# EasyEDA Pro project ProPrj_PCB_Design_2025-03-01.epro

# Schematic Aux Board
Board Name: Aux Board; Create Date: 2025-02-28; Page Name: P1; Project Name: PCB_Design; Schematic Name: Aux Board; Update Date: 2025-02-28; Company: EasyEDA.com; Page Size: A4; Version: V1.0
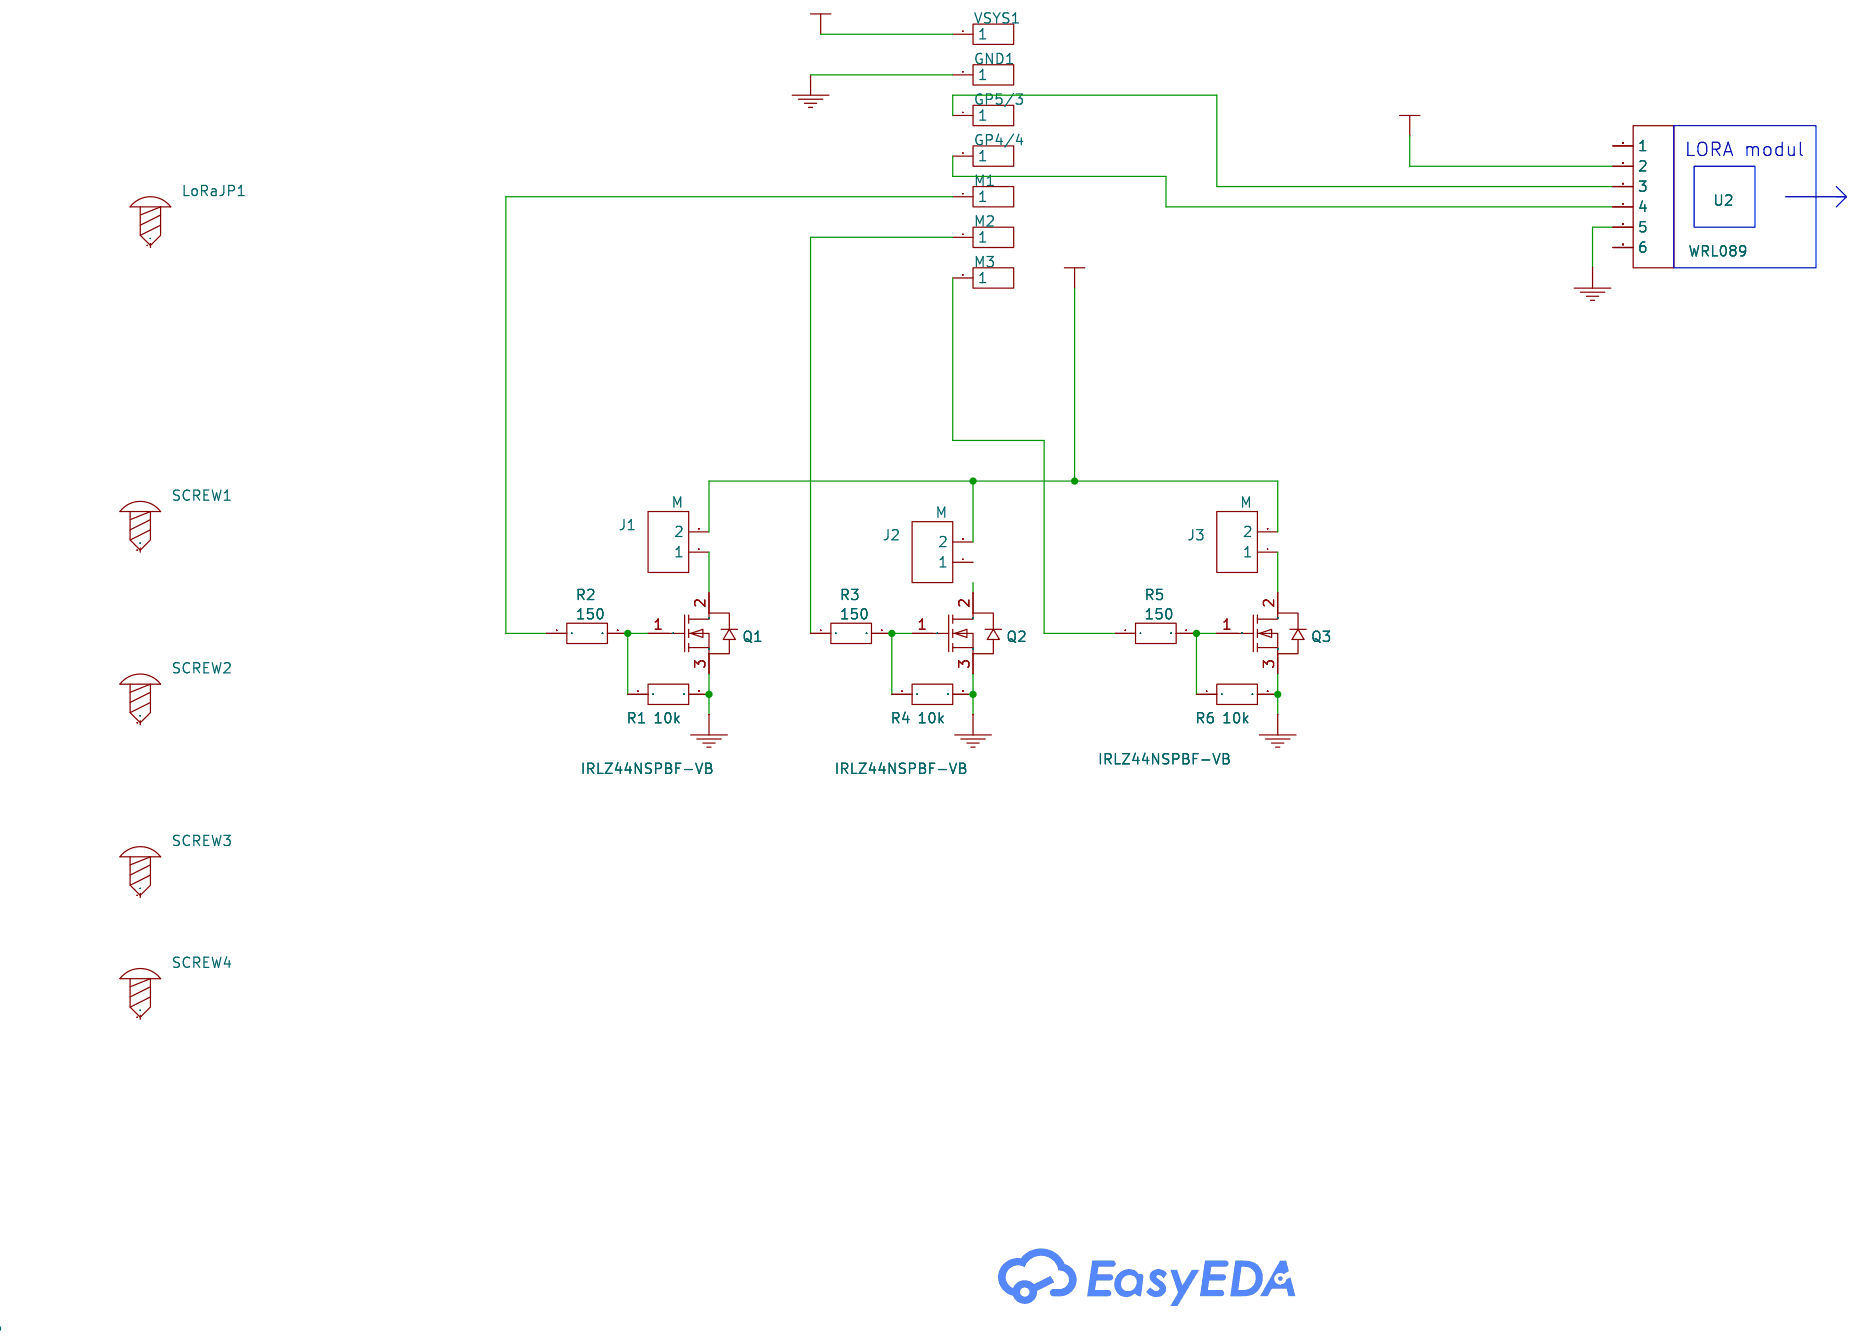
[diagram p0: schematic sheet]

## Parts
GND1  -  [HDR-TH_1P-V-M_XKB_X4611WV-01I-C28D40]
GP4/4  -  [HDR-TH_1P-V-M_XKB_X4611WV-01I-C28D40]
GP5/3  -  [HDR-TH_1P-V-M_XKB_X4611WV-01I-C28D40]
J1  M  [HDR-M-2.54_1X2]
J2  M  [HDR-M-2.54_1X2]
J3  M  [HDR-M-2.54_1X2]
LoRaJP1  -  [Screw-Hole-M2]
M1  -  [HDR-TH_1P-V-M_XKB_X4611WV-01I-C28D40]
M2  -  [HDR-TH_1P-V-M_XKB_X4611WV-01I-C28D40]
M3  -  [HDR-TH_1P-V-M_XKB_X4611WV-01I-C28D40]
Q1  IRLZ44NSPBF-VB  [TO-263-3_L10.2-W9.2-P5.08-LS15.4-BR]
Q2  IRLZ44NSPBF-VB  [TO-263-3_L10.2-W9.2-P5.08-LS15.4-BR]
Q3  IRLZ44NSPBF-VB  [TO-263-3_L10.2-W9.2-P5.08-LS15.4-BR]
R1  10k  [R_AXIAL-0.3]
R2  150  [R_AXIAL-0.3]
R3  150  [R_AXIAL-0.3]
R4  10k  [R_AXIAL-0.3]
R5  150  [R_AXIAL-0.3]
R6  10k  [R_AXIAL-0.3]
SCREW1  -  [Screw-Hole-M2]
SCREW2  -  [Screw-Hole-M2]
SCREW3  -  [Screw-Hole-M2]
SCREW4  -  [Screw-Hole-M2]
U2  WRL089  [HDR-M-2.54_1X6]
VSYS1  -  [HDR-TH_1P-V-M_XKB_X4611WV-01I-C28D40]

## Library data of the parts
GND1 GP4/4 GP5/3 M1-M3 VSYS1 = HDR-M_2.54_1x1P: Supplier Footprint: Through
J1-J3 = M: Supplier Part: C124375; Supplier: LCSC
LoRaJP1 SCREW1-SCREW4 = Screw-Hole-M2: Supplier Footprint: 插件
Q1-Q3 = IRLZ44NSPBF-VB: Supplier: LCSC; Supplier Part: C19188232; Manufacturer: VBsemi(微碧半导体); JLCPCB Part Class: Extended Part
R1 R4 R6 = 10k
R2 R3 R5 = 150
U2 = WRL089: Supplier Part: C190819; Supplier: LCSC

## Nets
GND: GND1.1 Q1.3(S) Q2.3(S) Q3.3(S) R1.2 R4.2 R6.2 U2.5
VCC: J1.2 J2.2 J3.2 U2.2 VSYS1.1
$1N474: J1.1 Q1.2(D)
$1N476: Q1.1(G) R1.1 R2.2
$1N477: Q2.1(G) R3.2 R4.1
$1N480: Q3.1(G) R5.2 R6.1
$1N482: J3.1 Q3.2(D)
$1N483: M1.1 R2.1
$1N484: M2.1 R3.1
$1N485: M3.1 R5.1
$1N943: GP5/3.1 U2.3
$1N947: GP4/4.1 U2.4

Not connected (* = marked no-connect by the designer): J2 1; LoRaJP1 1; Q2 2(D); SCREW1 1; SCREW2 1; SCREW3 1; SCREW4 1; U2 1 6

## Notes on the sheet
- LORA modul

# Schematic Full Hardware
Board Name: Full Hardware; Create Date: 2025-02-27; Page Name: P1; Project Name: PCB_Design; Schematic Name: Full Hardware; Update Date: 2025-02-28; Company: EasyEDA.com; Page Size: A4; Version: V1.0
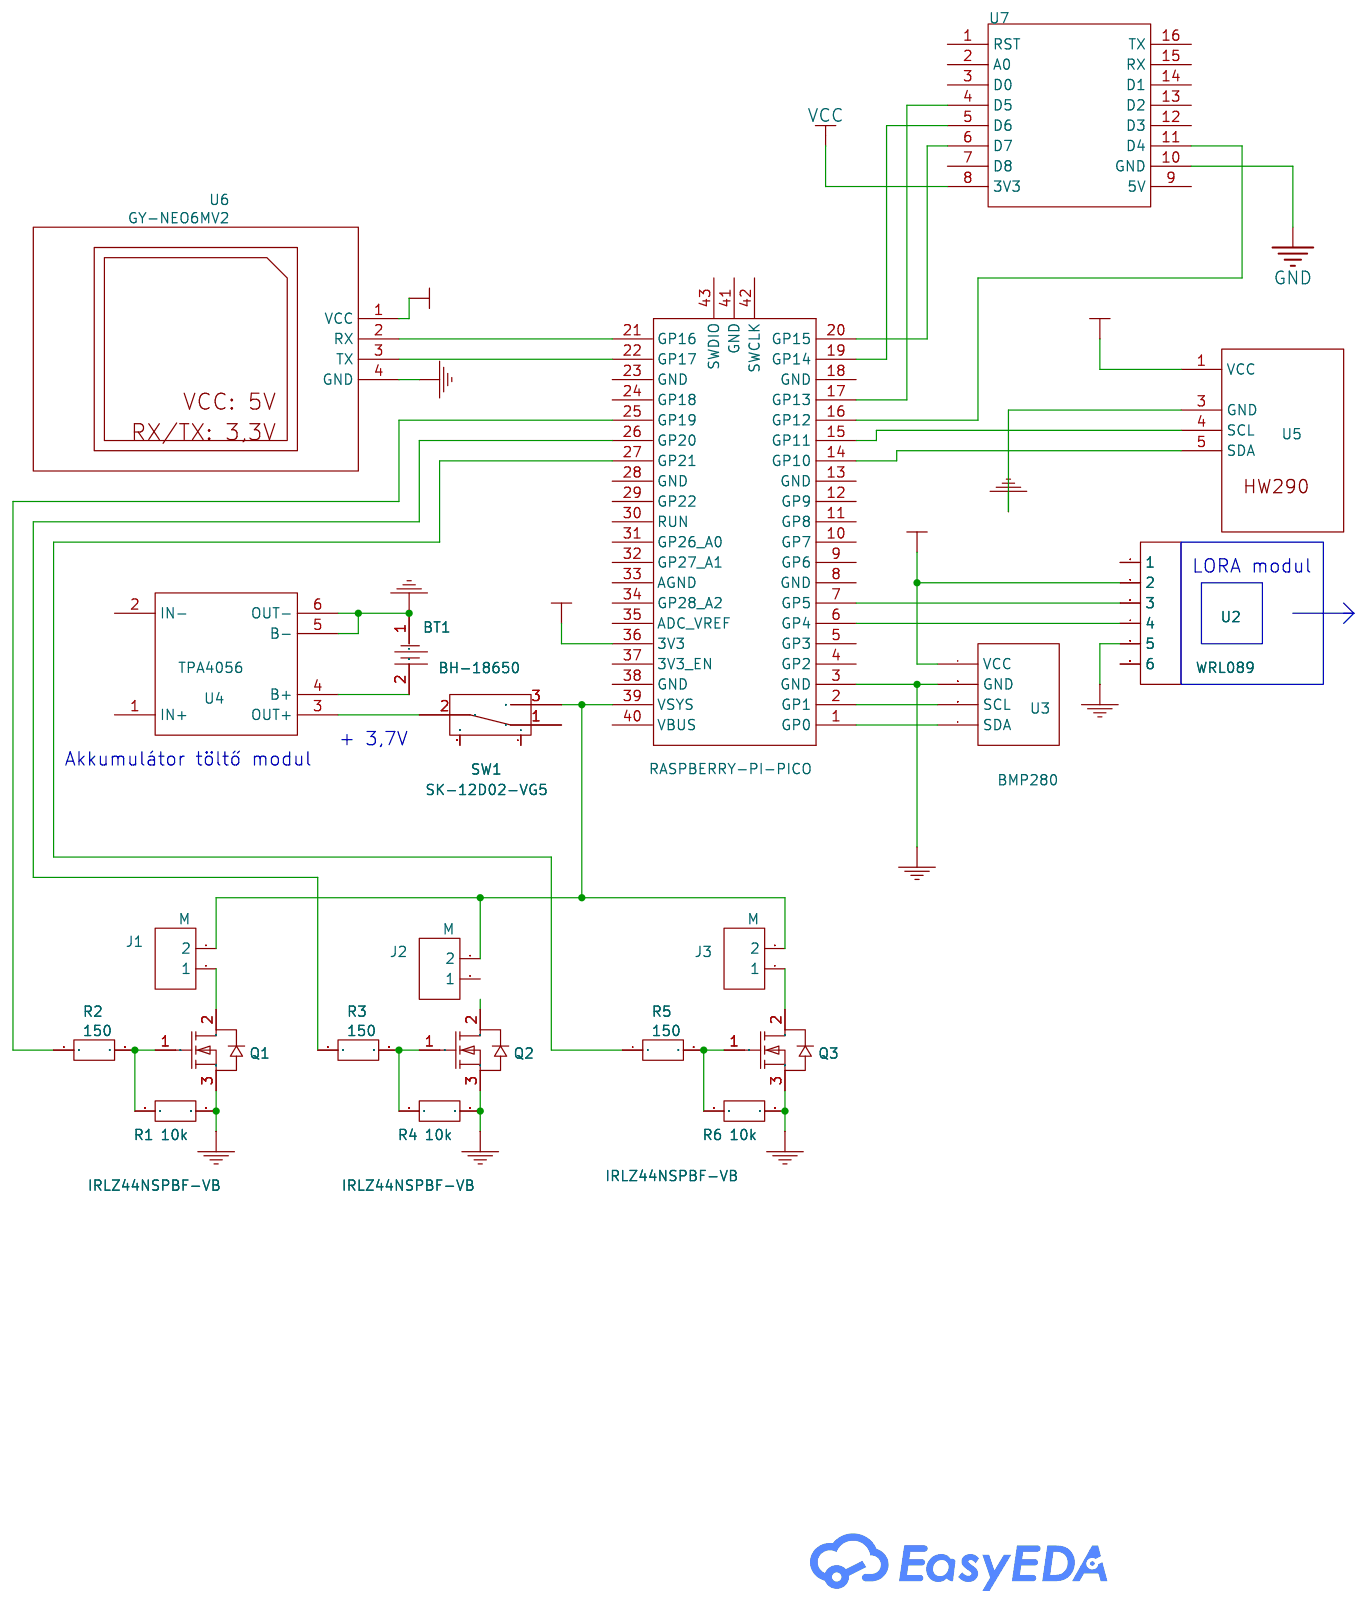
[diagram p1: schematic sheet]

## Parts
2  RASPBERRY-PI-PICO  [RASPBERRY-PI-PICO]  (no BOM)
BT1  BH-18650  [BATTERY-SMD_18650-1S-L77.1-W20.7-1]
J1  M  [HDR-M-2.54_1X2]
J2  M  [HDR-M-2.54_1X2]
J3  M  [HDR-M-2.54_1X2]
Q1  IRLZ44NSPBF-VB  [TO-263-3_L10.2-W9.2-P5.08-LS15.4-BR]
Q2  IRLZ44NSPBF-VB  [TO-263-3_L10.2-W9.2-P5.08-LS15.4-BR]
Q3  IRLZ44NSPBF-VB  [TO-263-3_L10.2-W9.2-P5.08-LS15.4-BR]
R1  10k  [R_AXIAL-0.3]
R2  150  [R_AXIAL-0.3]
R3  150  [R_AXIAL-0.3]
R4  10k  [R_AXIAL-0.3]
R5  150  [R_AXIAL-0.3]
R6  10k  [R_AXIAL-0.3]
SW1  SK-12D02-VG5  [SW-TH_SK-12D02VG3]
U2  WRL089  [HDR-M-2.54_1X6]
U3  BMP280  [BMP280YSF BMP280YSF BMP280YSF BMP]
U4  TPA4056  [TPA4056]
U5  HW290  [10DOF-HW290]
U6  GY-NEO6MV2  [mikroBUS_addOn_small]
U7  -  [MICROSD_SHIELD_WEMOS_D1_MINI]

## Library data of the parts
2 = RASPBERRY-PI-PICO: Supplier: Raspberry Pi; Supplier Part: RP2040; Manufacturer: Raspberry Pi Foundation
BT1 = BH-18650: Supplier: LCSC; Supplier Part: C2988620; Manufacturer: MYOUNG(美阳); Manufacturer Part: BH-18650-B1BA002; JLCPCB Part Class: Extended Part
J1-J3 = M: Supplier Part: C124375; Supplier: LCSC
Q1-Q3 = IRLZ44NSPBF-VB: Supplier: LCSC; Supplier Part: C19188232; Manufacturer: VBsemi(微碧半导体); JLCPCB Part Class: Extended Part
R1 R4 R6 = 10k
R2 R3 R5 = 150
SW1 = SK-12D02-VG5: Supplier: LCSC; Supplier Part: C136722; Manufacturer: Rectangular Connectors - Contacts
U2 = WRL089: Supplier Part: C190819; Supplier: LCSC
U3 = BMP280
U4 = TPA4056: Manufacturer Part: Djinn_sensor SchematicLib
U5 = HW290
U6 = GPSmikrob
U7 = MICROSD_SHIELD_WEMOS_D1_MINI

## Nets
GND: 2.3(GND) BT1.1 Q1.3(S) Q2.3(S) Q3.3(S) R1.2 R4.2 R6.2 U2.5 U3.6(GND) U4.5(B-) U4.6(OUT-) U5.3(GND) U6.4(GND) U7.10(GND)
VCC: 2.36(3V3) U2.2 U3.7(VCC) U5.1(VCC) U6.1(VCC) U7.8(3V3)
$1N884: 2.6(GP4) U2.4
$1N885: 2.7(GP5) U2.3
$1N886: 2.21(GP16) U6.2(RX)
$1N887: 2.22(GP17) U6.3(TX)
$1N890: 2.1(GP0) U3.4(SDA)
$1N891: 2.2(GP1) U3.5(SCL)
$1N894: BT1.2 U4.4(B+)
$1N896: 2.39(VSYS) J1.2 J2.2 J3.2 SW1.3
$1N897: SW1.2 U4.3(OUT+)
$1N902: J1.1 Q1.2(D)
$1N904: Q1.1(G) R1.1 R2.2
$1N905: Q2.1(G) R3.2 R4.1
$1N908: Q3.1(G) R5.2 R6.1
$1N910: J3.1 Q3.2(D)
$1N911: 2.25(GP19) R2.1
$1N912: 2.26(GP20) R3.1
$1N913: 2.27(GP21) R5.1
$1N3268: 2.16(GP12) U7.11(D4)
$1N3327: 2.17(GP13) U7.4(D5)
$1N3334: 2.19(GP14) U7.5(D6)
$1N3341: 2.20(GP15) U7.6(D7)
Net-(2-14): 2.14(GP10) U5.5(SDA)
Net-(2-15): 2.15(GP11) U5.4(SCL)

Not connected (* = marked no-connect by the designer): 2 4(GP2) 5(GP3) 8(GND) 9(GP6) 10(GP7) 11(GP8) 12(GP9) 13(GND) 18(GND) 23(GND) 24(GP18) 28(GND) 29(GP22) 30(RUN) 31(GP26_A0) 32(GP27_A1) 33(AGND) 34(GP28_A2) 35(ADC_VREF) 37(3V3_EN) 38(GND) 40(VBUS) 41(GND) 42(SWCLK) 43(SWDIO); J2 1; Q2 2(D); SW1 1 4 5; U2 1 6; U4 1(IN+) 2(IN-); U7 1(RST) 2(A0) 3(D0) 7(D8) 9(5V) 12(D3) 13(D2) 14(D1) 15(RX) 16(TX)

## Notes on the sheet
- LORA modul
- + 3,7V
- Akkumulátor töltő modul

# Schematic Main Board
Board Name: Main Board; Create Date: 2025-02-28; Page Name: P1; Project Name: PCB_Design; Schematic Name: Main Board; Update Date: 2025-02-28; Company: EasyEDA.com; Page Size: A4; Version: V1.0
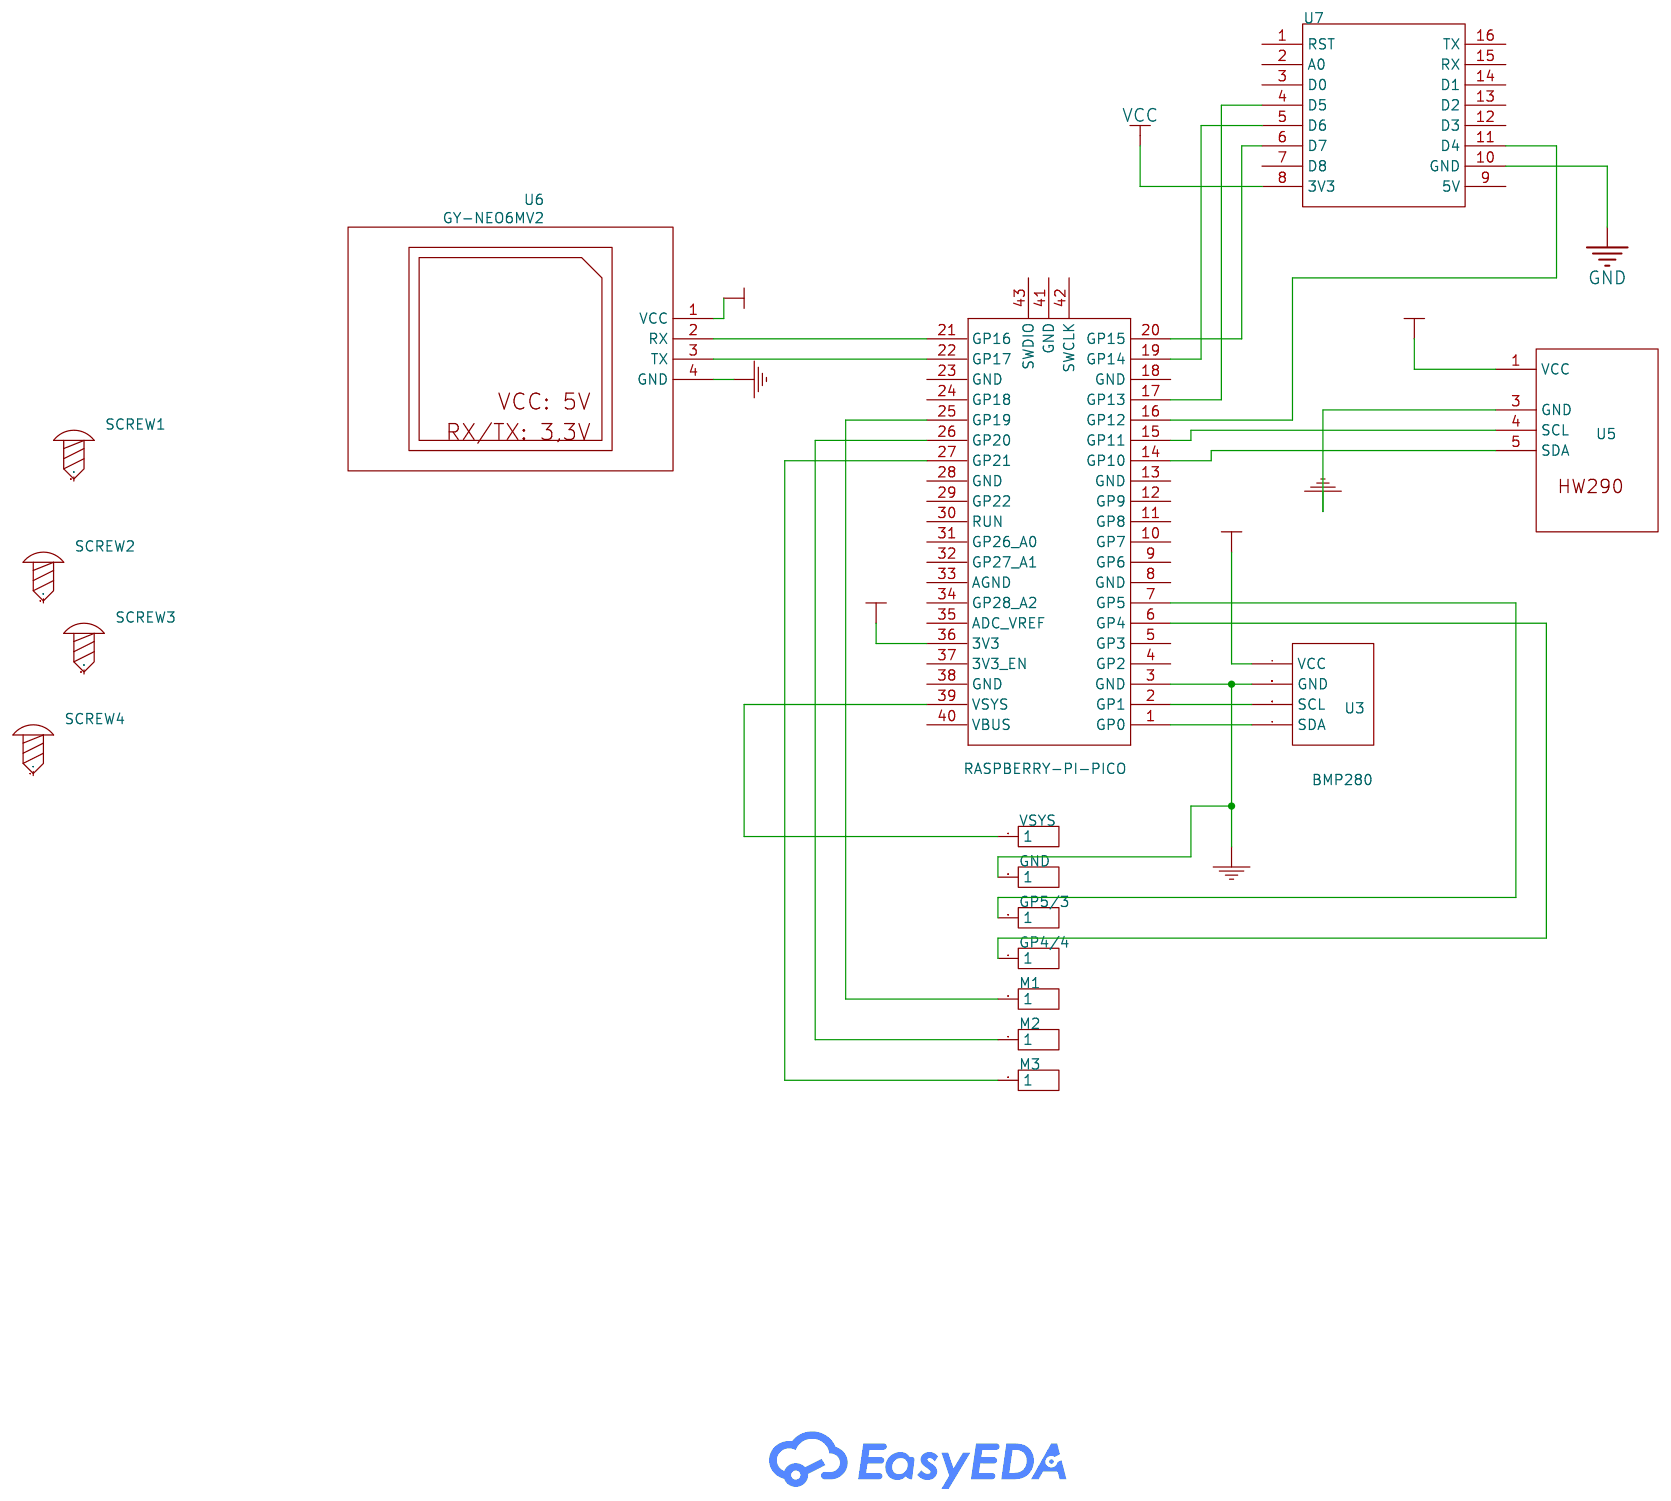
[diagram p2: schematic sheet]

## Parts
2  RASPBERRY-PI-PICO  [RASPBERRY-PI-PICO]  (no BOM)
GND  -  [HDR-TH_1P-V-M_XKB_X4611WV-01I-C28D40]
GP4/4  -  [HDR-TH_1P-V-M_XKB_X4611WV-01I-C28D40]
GP5/3  -  [HDR-TH_1P-V-M_XKB_X4611WV-01I-C28D40]
M1  -  [HDR-TH_1P-V-M_XKB_X4611WV-01I-C28D40]
M2  -  [HDR-TH_1P-V-M_XKB_X4611WV-01I-C28D40]
M3  -  [HDR-TH_1P-V-M_XKB_X4611WV-01I-C28D40]
SCREW1  -  [Screw-Hole-M2]
SCREW2  -  [Screw-Hole-M2]
SCREW3  -  [Screw-Hole-M2]
SCREW4  -  [Screw-Hole-M2]
U3  BMP280  [BMP280YSF BMP280YSF BMP280YSF BMP]
U5  HW290  [10DOF-HW290]
U6  GY-NEO6MV2  [mikroBUS_addOn_small]
U7  -  [MICROSD_SHIELD_WEMOS_D1_MINI]
VSYS  -  [HDR-TH_1P-V-M_XKB_X4611WV-01I-C28D40]

## Library data of the parts
2 = RASPBERRY-PI-PICO: Supplier: Raspberry Pi; Supplier Part: RP2040; Manufacturer: Raspberry Pi Foundation
GND GP4/4 GP5/3 M1-M3 VSYS = HDR-M_2.54_1x1P: Supplier Footprint: Through
SCREW1-SCREW4 = Screw-Hole-M2: Supplier Footprint: 插件
U3 = BMP280
U5 = HW290
U6 = GPSmikrob
U7 = MICROSD_SHIELD_WEMOS_D1_MINI

## Nets
GND: 2.3(GND) GND.1 U3.6(GND) U5.3(GND) U6.4(GND) U7.10(GND)
VCC: 2.36(3V3) U3.7(VCC) U5.1(VCC) U6.1(VCC) U7.8(3V3)
$1N398: 2.21(GP16) U6.2(RX)
$1N399: 2.22(GP17) U6.3(TX)
$1N404: 2.2(GP1) U3.5(SCL)
$1N405: 2.1(GP0) U3.4(SDA)
$1N408: 2.15(GP11) U5.4(SCL)
$1N409: 2.14(GP10) U5.5(SDA)
$1N413: 2.16(GP12) U7.11(D4)
$1N414: 2.17(GP13) U7.4(D5)
$1N415: 2.19(GP14) U7.5(D6)
$1N416: 2.20(GP15) U7.6(D7)
$1N830: 2.39(VSYS) VSYS.1
$1N861: 2.6(GP4) GP4/4.1
$1N868: 2.7(GP5) GP5/3.1
$1N897: 2.25(GP19) M1.1
$1N903: 2.26(GP20) M2.1
$1N913: 2.27(GP21) M3.1

Not connected (* = marked no-connect by the designer): 2 4(GP2) 5(GP3) 8(GND) 9(GP6) 10(GP7) 11(GP8) 12(GP9) 13(GND) 18(GND) 23(GND) 24(GP18) 28(GND) 29(GP22) 30(RUN) 31(GP26_A0) 32(GP27_A1) 33(AGND) 34(GP28_A2) 35(ADC_VREF) 37(3V3_EN) 38(GND) 40(VBUS) 41(GND) 42(SWCLK) 43(SWDIO); SCREW1 1; SCREW2 1; SCREW3 1; SCREW4 1; U7 1(RST) 2(A0) 3(D0) 7(D8) 9(5V) 12(D3) 13(D2) 14(D1) 15(RX) 16(TX)

# Board Aux PCB
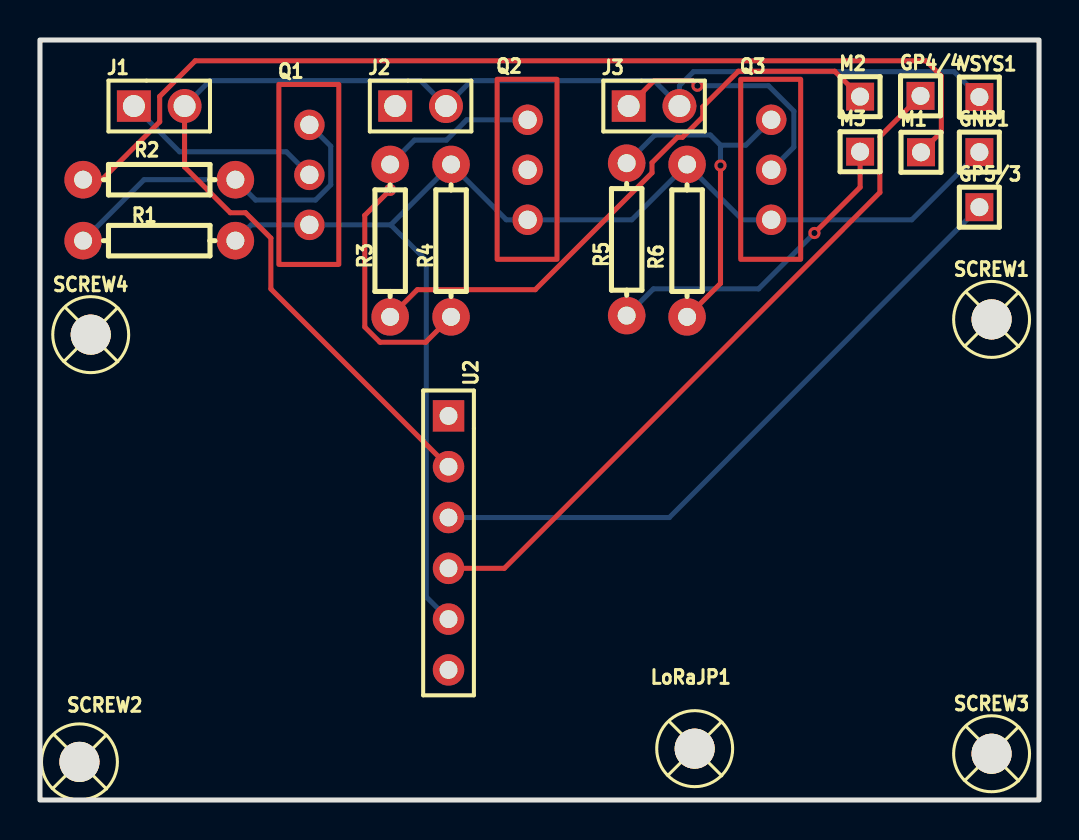
[diagram p3: board, top side]
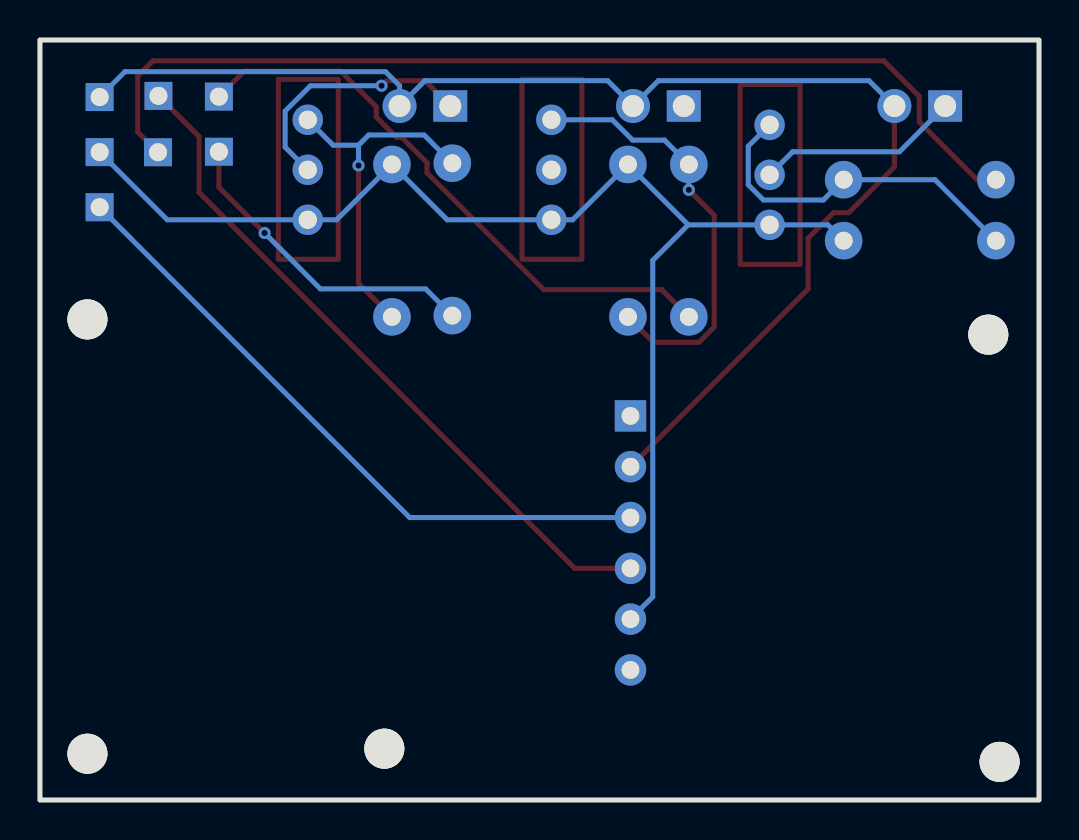
[diagram p4: board, bottom side, seen from below]

Outline 50 x 38 mm; copper layers: Top Layer, Bottom Layer. Coordinates in mm from the lower left corner of the outline.
Outline path: rectangle 0,38 50,0
Stack: Top Layer 0.035mm / Dielectric1 1.51mm FR4 er 4.5 / Bottom Layer 0.035mm

## Design rules (mm)
template: JLCPCB Capability(Two Layers Board)
spacing copperThickness1oz (default): track to track 0.102, other pairs 0.152 to 0.3
spacing copperThickness2oz: track to track 0.203, other pairs 0.152 to 0.3
track width copperThickness1oz (default): min 0.127, default 0.254, max 2.54
track width copperThickness2oz: min 0.203, default 0.254, max 2.54
differential pair differentialPair (default): width min 0.127, default 0.254, max 2.54; gap min 0.152, default 0.152
via viaSize (default): diameter min 0.5, default 0.61, max 10; hole min 0.3, default 0.305, max 6.3

## Placement (name value [footprint] x y rotation side)
GND1  -  [HDR-TH_1P-V-M_XKB_X4611WV-01I-C28D40]  47.01 32.39 0 top
GP4/4  -  [HDR-TH_1P-V-M_XKB_X4611WV-01I-C28D40]  44.07 35.21 0 top
GP5/3  -  [HDR-TH_1P-V-M_XKB_X4611WV-01I-C28D40]  47.01 29.64 0 top
J1  M  [HDR-M-2.54_1X2]  5.97 34.7 0 top
J2  M  [HDR-M-2.54_1X2]  19.05 34.7 0 top
J3  M  [HDR-M-2.54_1X2]  30.73 34.7 0 top
LoRaJP1  -  [Screw-Hole-M2]  32.77 2.57 0 top
M1  -  [HDR-TH_1P-V-M_XKB_X4611WV-01I-C28D40]  44.09 32.39 0 top
M2  -  [HDR-TH_1P-V-M_XKB_X4611WV-01I-C28D40]  41.04 35.17 0 top
M3  -  [HDR-TH_1P-V-M_XKB_X4611WV-01I-C28D40]  41.04 32.41 0 top
Q1  IRLZ44NSPBF-VB  [TO-263-3_L10.2-W9.2-P5.08-LS15.4-BR]  13.46 31.27 0 top
Q2  IRLZ44NSPBF-VB  [TO-263-3_L10.2-W9.2-P5.08-LS15.4-BR]  24.38 31.52 0 top
Q3  IRLZ44NSPBF-VB  [TO-263-3_L10.2-W9.2-P5.08-LS15.4-BR]  36.58 31.52 0 top
R1  10k  [R_AXIAL-0.3]  5.97 27.97 0 top
R2  150  [R_AXIAL-0.3]  5.97 31.02 0 top
R3  150  [R_AXIAL-0.3]  17.53 27.97 90 top
R4  10k  [R_AXIAL-0.3]  20.57 27.97 90 top
R5  150  [R_AXIAL-0.3]  29.36 28.03 90 top
R6  10k  [R_AXIAL-0.3]  32.39 27.97 90 top
SCREW1  -  [Screw-Hole-M2#2]  47.62 24.03 0 top
SCREW2  -  [Screw-Hole-M2#2]  1.98 1.91 0 top
SCREW3  -  [Screw-Hole-M2#2]  47.62 2.31 0 top
SCREW4  -  [Screw-Hole-M2#2]  2.54 23.27 0 top
U2  WRL089  [HDR-M-2.54_1X6]  20.45 12.85 270 top
VSYS1  -  [HDR-TH_1P-V-M_XKB_X4611WV-01I-C28D40]  47.01 35.15 0 top

## Footprints (pads in the part's own frame, mm; a bottom-side part is the same pattern mirrored in y, then rotated)
HDR-M-2.54_1X2
  rect 1.7x1.575 hole 1.1: 1(-1.27,0)
  round 1.7 hole 1.1: 2(1.27,0)
HDR-M-2.54_1X6
  rect 1.575x1.575 hole 0.889: 1(-6.35,0)
  round 1.575 hole 0.889: 2(-3.81,0) 3(-1.27,0) 4(1.27,0) 5(3.81,0) 6(6.35,0)
HDR-TH_1P-V-M_XKB_X4611WV-01I-C28D40
  rect 1.4x1.4 hole 0.9: 1(0,0)
R_AXIAL-0.3
  round 1.879 hole 0.899: 1(-3.81,0) 2(3.81,0)
Screw-Hole-M2
  round 2 hole 5: 1(0,0)
Screw-Hole-M2#2
  round 2 hole 2: 1(0,0)
TO-263-3_L10.2-W9.2-P5.08-LS15.4-BR
  round 1.524 hole 0.914: 1(0.022,2.488) 2(0.022,-0.012) 3(0.022,-2.512)

## Nets
As in the schematic.

Pads without a net: J2 1; LoRaJP1 1; SCREW1 1; SCREW2 1; SCREW3 1; SCREW4 1; U2 1 6

## Via types
v1: diameter 0.61, hole 0.305, Top Layer to Bottom Layer, 4 vias

## Routing (per net, layer and track width the routed paths; a pad name or vN(x,y) marks a point on that pad's centre or on a via; arc(x,y) is an arc through that point)
GND: length 64.6
  Bottom Layer w0.254: GND1.1 43.63,29.01 Q3.3 35.15,29.01 R6.2 29.62,29.01 Q2.3 23.34,29.01 R4.2 17.55,28.76 ; 17.55,28.76 19.33,26.98 19.33,10.16 U2.5 ; 17.55,28.76 Q1.3 10.57,28.76 R1.2
VCC: length 67.7
  Top Layer w0.254: J1.2 7.24,31.65 9.52,29.36 10.29,29.36 11.56,28.09 11.56,25.55 U2.2
  Bottom Layer w0.254: VSYS1.1 45.74,36.42 32.71,36.42 32,35.71 J3.2 30.73,35.97 21.59,35.97 J2.2 19.05,35.97 8.51,35.97 J1.2
$1N474: length 10.2
  Bottom Layer w0.254: J1.1 6.98,32.41 12.33,32.41 Q1.2
$1N476: length 17.8
  Bottom Layer w0.254: R1.1 5.21,31.02 R2.2 10.8,30 13.79,30 14.55,30.76 14.55,32.69 Q1.1
$1N477: length 21.6
  Top Layer w0.254: v1(17.53,30.51) 16.26,29.24 16.26,23.65 17.02,22.89 19.3,22.89 R4.1
  Bottom Layer w0.254: v1(17.53,30.51) R3.2 18.74,33 20.34,33 21.36,34.01 Q2.1
$1N480: length 17.8
  Top Layer w0.254: v1(34.06,31.72) 34.06,25.83 R6.1
  Bottom Layer w0.254: 34.06,32.74 33.55,33.25 30.77,33.25 R5.2 ; 34.06,32.74 v1(34.06,31.72) ; 34.06,32.74 35.33,32.74 Q3.1
$1N482: length 12.8
  Top Layer w0.254: J3.1 30.73,35.97 32.65,35.97 v1(32.9,35.71)
  Bottom Layer w0.254: Q3.2 37.73,32.64 37.73,34.44 36.46,35.71 v1(32.9,35.71)
$1N483: length 50.7
  Top Layer w0.254: R2.1 3.1,31.02 5.99,33.91 5.99,35.18 7.77,36.96 44.35,36.96 45.11,36.2 45.11,33.4 M1.1
$1N484: length 29.7
  Top Layer w0.254: M2.1 39.77,36.44 34.95,36.44 33.17,34.66 33.17,34.15 32.15,33.14 31.9,33.14 30.63,31.87 30.63,31.36 24.79,25.52 18.89,25.52 R3.1
$1N485: length 16.1
  Top Layer w0.254: M3.1 41.04,30.64 v1(38.76,28.35)
  Bottom Layer w0.254: R5.1 30.7,25.56 35.96,25.56 v1(38.76,28.35)
$1N943: length 33
  Bottom Layer w0.254: GP5/3.1 31.5,14.12 U2.3
$1N947: length 35
  Top Layer w0.254: U2.4 23.24,11.58 42.04,30.38 42.04,33.17 GP4/4.1

# Board Full PCB (concept)
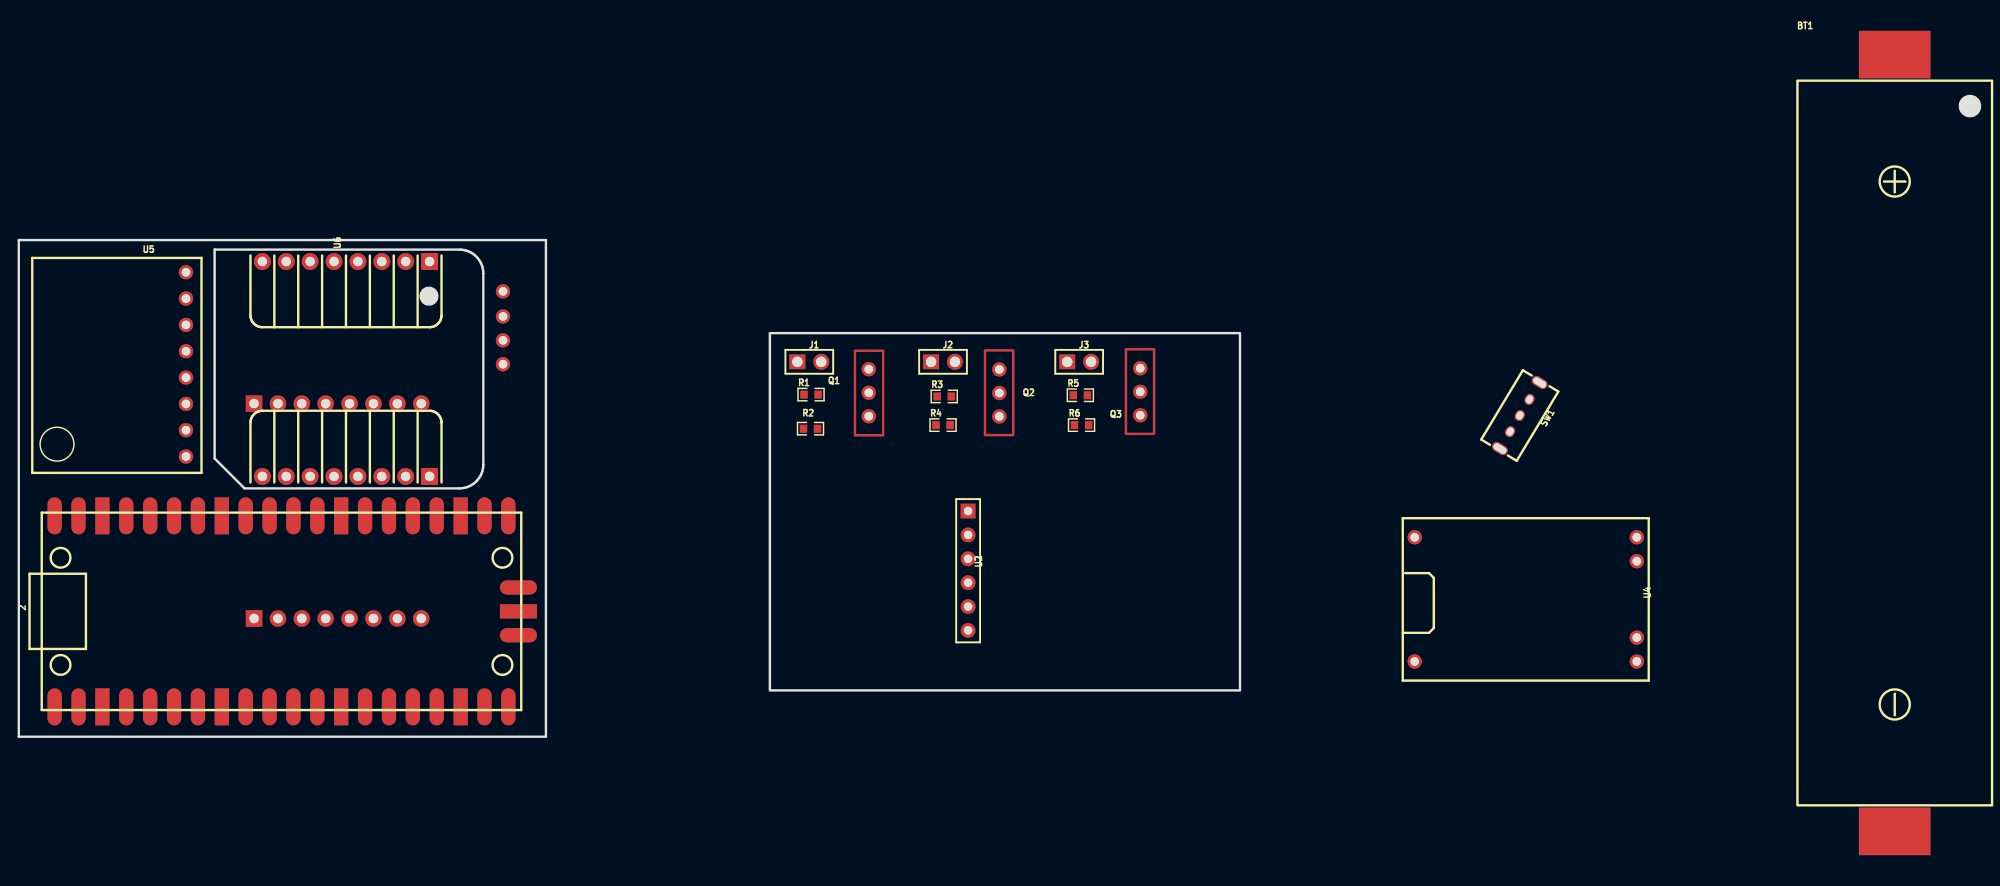
[diagram p5: board, top side]
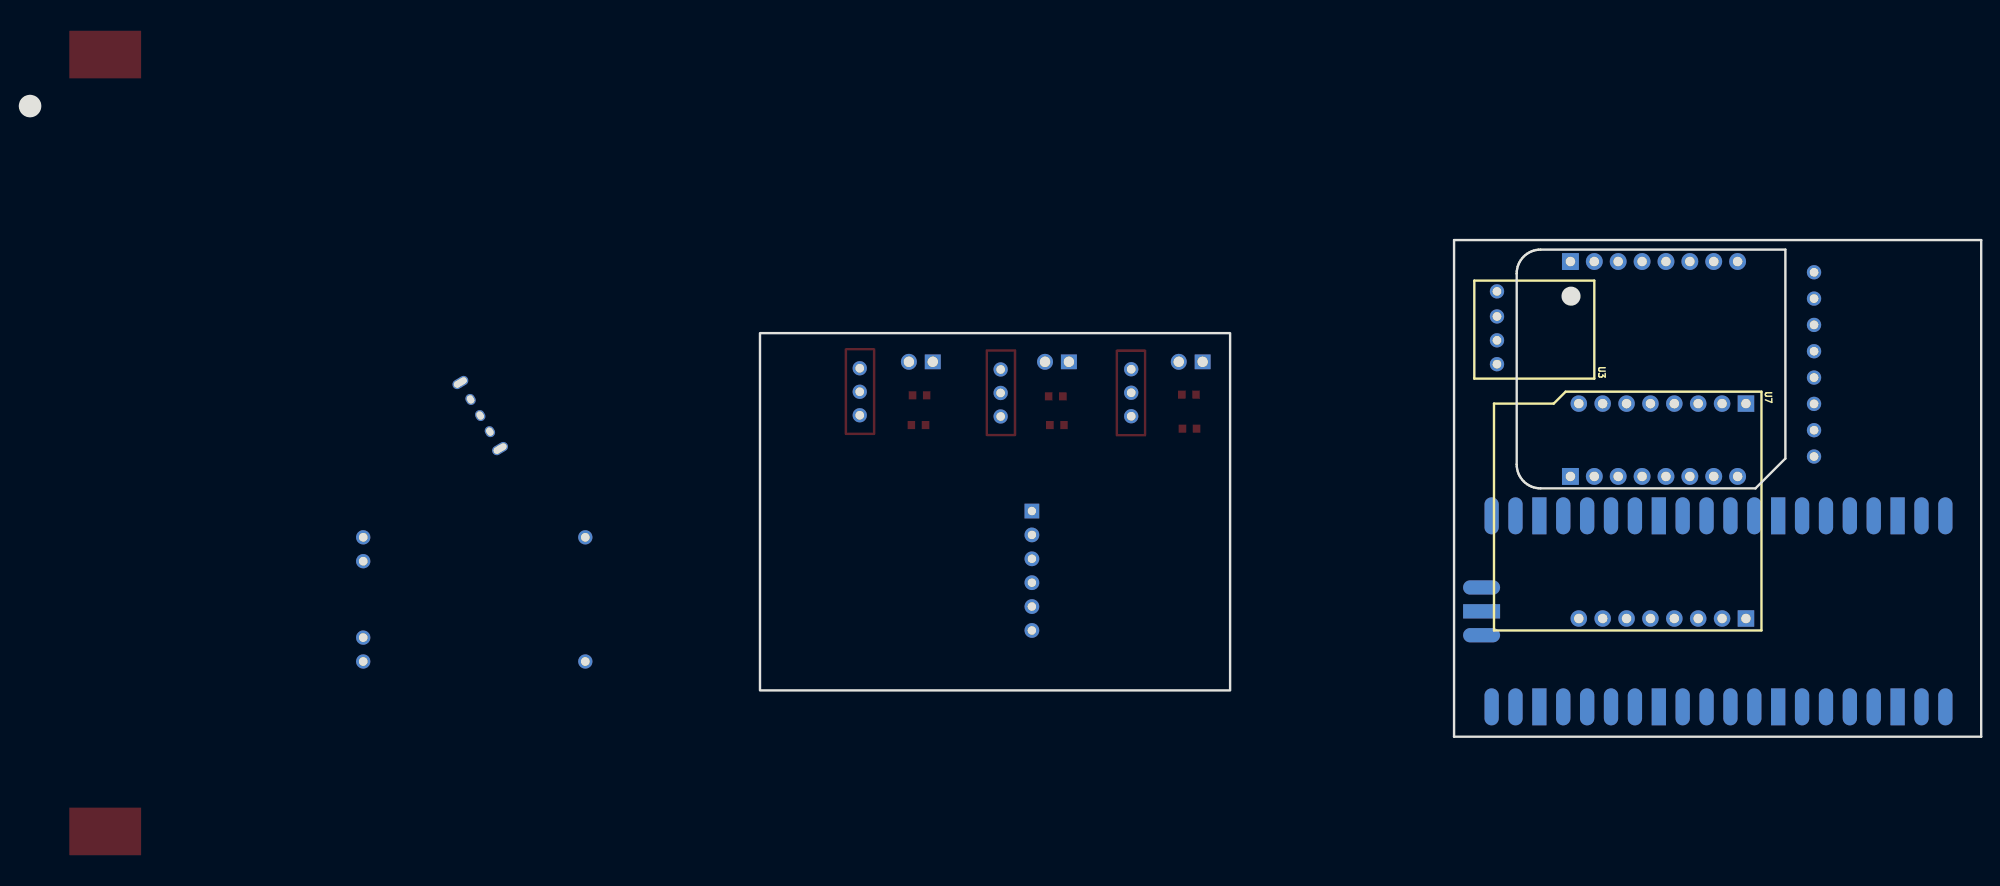
[diagram p6: board, bottom side, seen from below]

Outline 208.71 x 68.28 mm; copper layers: Top Layer, Bottom Layer. Coordinates in mm from the lower left corner of the outline.
Outline path: rectangle 79.88,42.93 129.88,4.93 ; 0,52.83 56.06,52.83 56.06,0 0,0 0,52.83
Stack: Top Layer 0.035mm / Dielectric1 1.51mm FR4 er 4.5 / Bottom Layer 0.035mm

## Design rules (mm)
spacing safeClearance (default): track to track 0.152, other pairs 0.152 to 0.3
track width trackWidth (default): min 0.127, default 0.254, max 2.54
differential pair differentialPair (default): width min 0.127, default 0.254, max 2.54; gap min 0.152, default 0.152
via viaSize (default): diameter min 0.5, default 0.61, max 10; hole min 0.3, default 0.305, max 6

## Placement (name value [footprint] x y rotation side)
2  -  [RASPBERRY-PI-PICO]  27.94 13.33 90 top
BT1  BH-18650  [BATTERY-SMD_18650-1S-L77.1-W20.7-1]  199.52 31.24 0 top
J1  M  [HDR-M-2.54_1X2]  84.07 39.88 0 top
J2  M  [HDR-M-2.54_1X2]  98.3 39.88 0 top
J3  M  [HDR-M-2.54_1X2]  112.78 39.88 0 top
Q1  IRLZ44NSPBF-VB  [TO-263-3_L10.2-W9.2-P5.08-LS15.4-BR]  90.42 36.58 180 top
Q2  IRLZ44NSPBF-VB  [TO-263-3_L10.2-W9.2-P5.08-LS15.4-BR]  104.27 36.58 0 top
Q3  IRLZ44NSPBF-VB  [TO-263-3_L10.2-W9.2-P5.08-LS15.4-BR]  119.25 36.7 0 top
R1  10k  [R0603]  84.26 36.39 0 top
R2  150  [R0603]  84.2 32.77 0 top
R3  150  [R0603]  98.43 36.19 0 top
R4  10k  [R0603]  98.3 33.15 0 top
R5  150  [R0603]  112.9 36.32 0 top
R6  10k  [R0603]  113.03 33.15 0 top
SW1  SK-12D02-VG5  [SW-TH_SK-12D02VG3]  159.64 34.16 239 top
U2  WRL089  [HDR-M-2.54_1X6]  100.97 17.65 270 top
U3  BMP280  [BMP280YSF BMP280YSF BMP280YSF BMP]  47.12 42.29 270 bottom
U4  -  [TPA4056]  147.19 23.24 270 top
U5  HW290  [10DOF-HW290]  18.16 40.77 0 top
U6  GY-NEO6MV2  [mikroBUS_addOn_small]  20.83 51.82 270 top
U7  -  [MICROSD_SHIELD_WEMOS_D1_MINI]  36.96 24.26 270 bottom

## Footprints (pads in the part's own frame, mm; a bottom-side part is the same pattern mirrored in y, then rotated)
10DOF-HW290
  round 1.524 hole 0.914: 0(-0.381,-10.964) 1(-0.381,-8.164) 3(-0.381,-5.364) 4(-0.381,-2.564) 5(-0.381,0.236) 6(-0.381,3.036) 7(-0.381,5.836) 8(-0.381,8.636)
BATTERY-SMD_18650-1S-L77.1-W20.7-1
  rect 7.62x5.08 smd: 1(0,-41.313) 2(0,41.313)
BMP280YSF BMP280YSF BMP280YSF BMP
  round 1.524 hole 0.914: 4(2.667,-4.381) 5(0.127,-4.381) 6(-2.413,-4.381) 7(-5.08,-4.381)
HDR-M-2.54_1X2
  rect 1.7x1.575 hole 1.1: 1(-1.27,0)
  round 1.7 hole 1.1: 2(1.27,0)
HDR-M-2.54_1X6
  rect 1.575x1.575 hole 0.889: 1(-6.35,0)
  round 1.575 hole 0.889: 2(-3.81,0) 3(-1.27,0) 4(1.27,0) 5(3.81,0) 6(6.35,0)
MICROSD_SHIELD_WEMOS_D1_MINI
  rect 1.762x1.762 hole 1: 1(-11.176,11.938) 16(11.684,11.938)
  round 1.762 hole 1: 2(-11.176,9.398) 3(-11.176,6.858) 4(-11.176,4.318) 5(-11.176,1.778) 6(-11.176,-0.762) 7(-11.176,-3.302) 8(-11.176,-5.842) 9(11.684,-5.842) 10(11.684,-3.302) 11(11.684,-0.762) 12(11.684,1.778) 13(11.684,4.318) 14(11.684,6.858) 15(11.684,9.398)
mikroBUS_addOn_small
  rect 1.8x1.8 hole 1: 1(1.27,22.86) 16(24.13,22.86)
  round 1.8 hole 1: 2(1.27,20.32) 3(1.27,17.78) 4(1.27,15.24) 5(1.27,12.7) 6(1.27,10.16) 7(1.27,7.62) 8(1.27,5.08) 9(24.13,5.08) 10(24.13,7.62) 11(24.13,10.16) 12(24.13,12.7) 13(24.13,15.24) 14(24.13,17.78) 15(24.13,20.32)
R0603
  rect 0.806x0.864 smd: 1(-0.753,0) 2(0.753,0)
RASPBERRY-PI-PICO
  custom 3.937x1.524 hole 0.85: 1(-10.16,24.13) 2(-10.16,21.59) 4(-10.16,16.51) 5(-10.16,13.97) 6(-10.16,11.43) 7(-10.16,8.89) 9(-10.16,3.81) 10(-10.16,1.27) 11(-10.16,-1.27) 12(-10.16,-3.81) 14(-10.16,-8.89) 15(-10.16,-11.43) 16(-10.16,-13.97) 17(-10.16,-16.51) 19(-10.16,-21.59) 20(-10.16,-24.13) 21(10.16,-24.13) 22(10.16,-21.59) 24(10.16,-16.51) 25(10.16,-13.97) 26(10.16,-11.43) 27(10.16,-8.89) 29(10.16,-3.81) 30(10.16,-1.27) 31(10.16,1.27) 32(10.16,3.81) 34(10.16,8.89) 35(10.16,11.43) 36(10.16,13.97) 37(10.16,16.51) 39(10.16,21.59) 40(10.16,24.13)
  custom 3.936x1.524 hole 0.85: 3(-10.16,19.05) 8(-10.16,6.35) 13(-10.16,-6.35) 18(-10.16,-19.05) 23(10.16,-19.05) 28(10.16,-6.35) 33(10.16,6.35) 38(10.16,19.05)
  custom 1.524x3.936 hole 0.85: 41(-2.54,-25.197) 42(0,-25.197) 43(2.54,-25.197)
SW-TH_SK-12D02VG3
  oval 1.2x1 hole 0.9x0.7: 1(-1.998,0) 2(0.001,0) 3(1.999,0)
  oval 1x1.8 hole 0.7x1.5: 4(4.099,0) 5(-4.099,0)
TO-263-3_L10.2-W9.2-P5.08-LS15.4-BR
  round 1.524 hole 0.914: 1(0.022,2.488) 2(0.022,-0.012) 3(0.022,-2.512)
TPA4056
  round 1.524 hole 0.914: 1(2.032,1.27) 2(15.24,1.27) 3(2.032,24.892) 4(4.572,24.892) 5(12.7,24.892) 6(15.24,24.892)

## Nets
As in the schematic, except:
GND: 2.3 BT1.1 Q1.3 Q2.3 Q3.3 R1.2 R4.2 R6.2 U2.5 U3.6 U4.5 U4.6 U6.4 U7.10
VCC: 2.36 U2.2 U3.7 U6.1 U7.8

Pads without a net: 2 4 5 8 9 10 11 12 13 18 23 24 28 29 30 31 32 33 34 35 37 38 40 41 42 43; J2 1; SW1 1 4 5; U2 1 6; U4 1 2; U5 0 1 3 4 5 6 7 8; U6 5 6 7 8 9 10 11 12 13 14 15 16; U7 1 2 3 7 9 12 13 14 15 16

# Board Main PCB
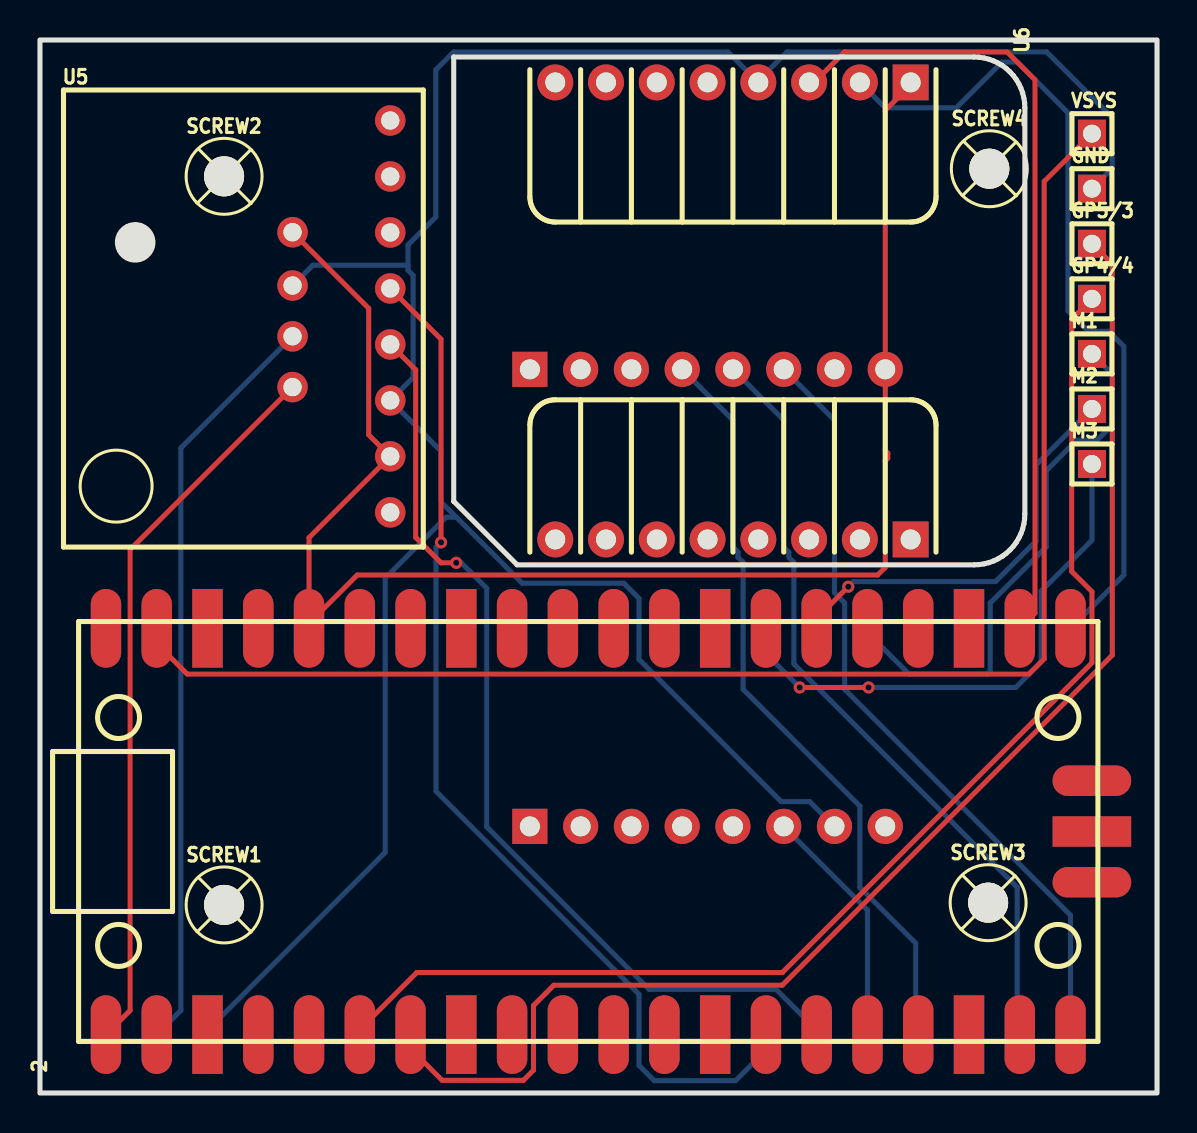
[diagram p7: board, top side]
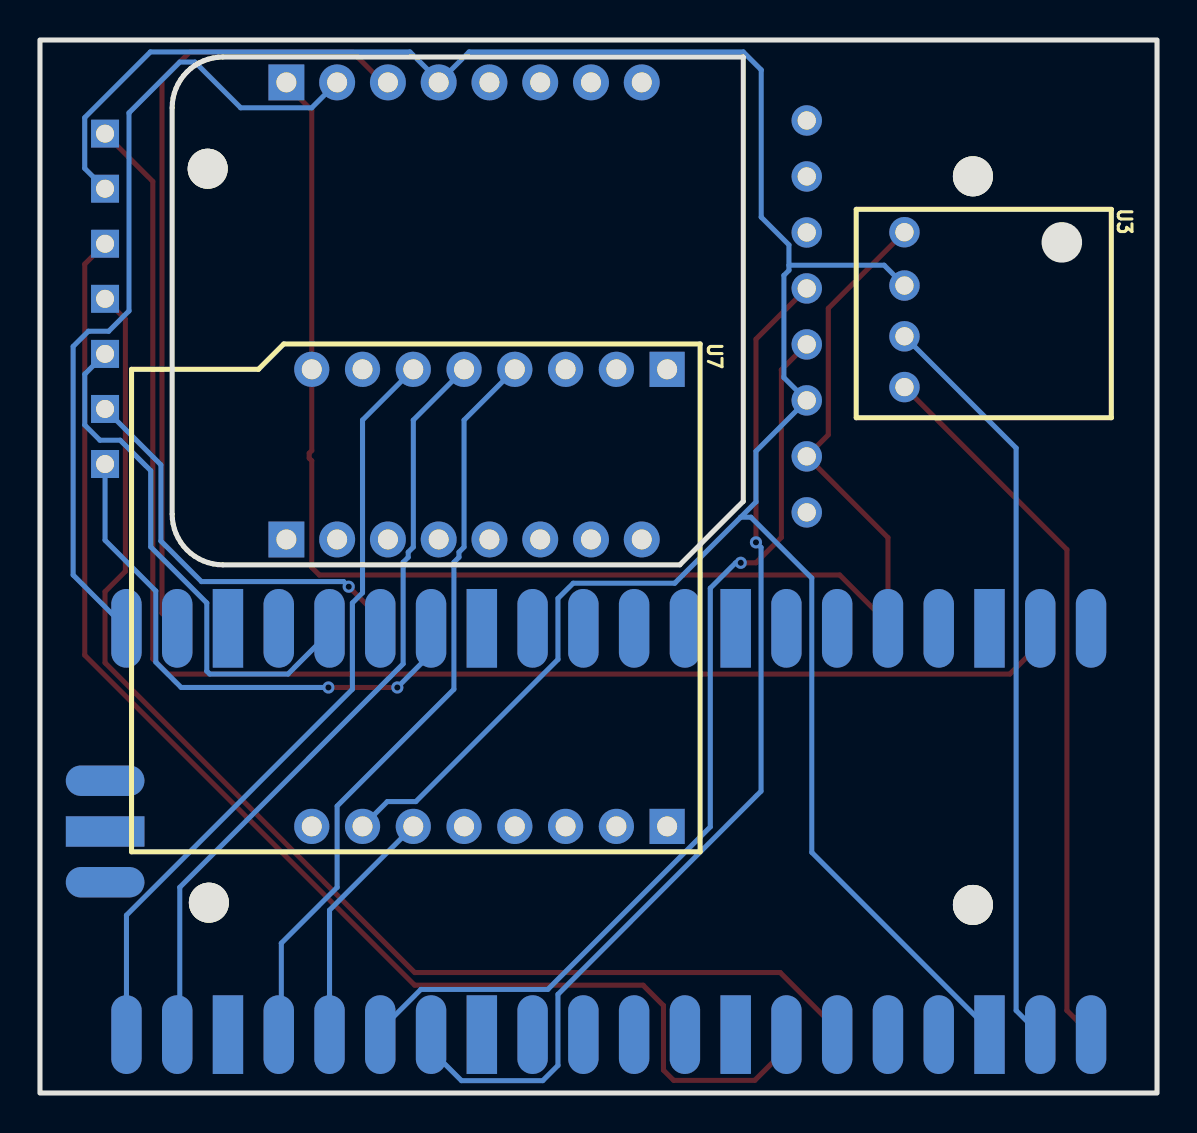
[diagram p8: board, bottom side, seen from below]

Outline 55.89 x 52.67 mm; copper layers: Top Layer, Bottom Layer. Coordinates in mm from the lower left corner of the outline.
Outline path: rectangle 0,52.67 55.89,0
Stack: Top Layer 0.035mm / Dielectric1 1.51mm FR4 er 4.5 / Bottom Layer 0.035mm

## Design rules (mm)
template: JLCPCB Capability(Two Layers Board)
spacing copperThickness1oz (default): track to track 0.102, other pairs 0.152 to 0.3
spacing copperThickness2oz: track to track 0.203, other pairs 0.152 to 0.3
track width copperThickness1oz (default): min 0.127, default 0.254, max 2.54
track width copperThickness2oz: min 0.203, default 0.254, max 2.54
differential pair differentialPair (default): width min 0.127, default 0.254, max 2.54; gap min 0.152, default 0.152
via viaSize (default): diameter min 0.5, default 0.61, max 10; hole min 0.3, default 0.305, max 6.3

## Placement (name value [footprint] x y rotation side)
2  -  [RASPBERRY-PI-PICO]  27.43 13.08 90 top
GND  -  [HDR-TH_1P-V-M_XKB_X4611WV-01I-C28D40]  52.63 45.23 0 top
GP4/4  -  [HDR-TH_1P-V-M_XKB_X4611WV-01I-C28D40]  52.63 39.72 0 top
GP5/3  -  [HDR-TH_1P-V-M_XKB_X4611WV-01I-C28D40]  52.63 42.47 0 top
M1  -  [HDR-TH_1P-V-M_XKB_X4611WV-01I-C28D40]  52.63 36.97 0 top
M2  -  [HDR-TH_1P-V-M_XKB_X4611WV-01I-C28D40]  52.63 34.21 0 top
M3  -  [HDR-TH_1P-V-M_XKB_X4611WV-01I-C28D40]  52.63 31.46 0 top
SCREW1  -  [Screw-Hole-M2]  9.21 9.41 0 top
SCREW2  -  [Screw-Hole-M2]  9.21 45.85 0 top
SCREW3  -  [Screw-Hole-M2]  47.44 9.52 0 top
SCREW4  -  [Screw-Hole-M2]  47.5 46.23 0 top
U3  BMP280  [BMP280YSF BMP280YSF BMP280YSF BMP]  8.25 37.97 270 bottom
U5  HW290  [10DOF-HW290]  17.91 40 0 top
U6  GY-NEO6MV2  [mikroBUS_addOn_small]  20.7 51.82 270 top
U7  -  [MICROSD_SHIELD_WEMOS_D1_MINI]  36.45 25.02 270 bottom
VSYS  -  [HDR-TH_1P-V-M_XKB_X4611WV-01I-C28D40]  52.63 47.98 0 top

## Footprints (pads in the part's own frame, mm; a bottom-side part is the same pattern mirrored in y, then rotated)
10DOF-HW290
  round 1.524 hole 0.914: 0(-0.381,-10.964) 1(-0.381,-8.164) 3(-0.381,-5.364) 4(-0.381,-2.564) 5(-0.381,0.236) 6(-0.381,3.036) 7(-0.381,5.836) 8(-0.381,8.636)
BMP280YSF BMP280YSF BMP280YSF BMP
  round 1.524 hole 0.914: 4(2.667,-4.381) 5(0.127,-4.381) 6(-2.413,-4.381) 7(-5.08,-4.381)
HDR-TH_1P-V-M_XKB_X4611WV-01I-C28D40
  rect 1.4x1.4 hole 0.9: 1(0,0)
MICROSD_SHIELD_WEMOS_D1_MINI
  rect 1.762x1.762 hole 1: 1(-11.176,11.938) 16(11.684,11.938)
  round 1.762 hole 1: 2(-11.176,9.398) 3(-11.176,6.858) 4(-11.176,4.318) 5(-11.176,1.778) 6(-11.176,-0.762) 7(-11.176,-3.302) 8(-11.176,-5.842) 9(11.684,-5.842) 10(11.684,-3.302) 11(11.684,-0.762) 12(11.684,1.778) 13(11.684,4.318) 14(11.684,6.858) 15(11.684,9.398)
mikroBUS_addOn_small
  rect 1.8x1.8 hole 1: 1(1.27,22.86) 16(24.13,22.86)
  round 1.8 hole 1: 2(1.27,20.32) 3(1.27,17.78) 4(1.27,15.24) 5(1.27,12.7) 6(1.27,10.16) 7(1.27,7.62) 8(1.27,5.08) 9(24.13,5.08) 10(24.13,7.62) 11(24.13,10.16) 12(24.13,12.7) 13(24.13,15.24) 14(24.13,17.78) 15(24.13,20.32)
RASPBERRY-PI-PICO
  custom 3.937x1.524 hole 0.85: 1(-10.16,24.13) 2(-10.16,21.59) 4(-10.16,16.51) 5(-10.16,13.97) 6(-10.16,11.43) 7(-10.16,8.89) 9(-10.16,3.81) 10(-10.16,1.27) 11(-10.16,-1.27) 12(-10.16,-3.81) 14(-10.16,-8.89) 15(-10.16,-11.43) 16(-10.16,-13.97) 17(-10.16,-16.51) 19(-10.16,-21.59) 20(-10.16,-24.13) 21(10.16,-24.13) 22(10.16,-21.59) 24(10.16,-16.51) 25(10.16,-13.97) 26(10.16,-11.43) 27(10.16,-8.89) 29(10.16,-3.81) 30(10.16,-1.27) 31(10.16,1.27) 32(10.16,3.81) 34(10.16,8.89) 35(10.16,11.43) 36(10.16,13.97) 37(10.16,16.51) 39(10.16,21.59) 40(10.16,24.13)
  custom 3.936x1.524 hole 0.85: 3(-10.16,19.05) 8(-10.16,6.35) 13(-10.16,-6.35) 18(-10.16,-19.05) 23(10.16,-19.05) 28(10.16,-6.35) 33(10.16,6.35) 38(10.16,19.05)
  custom 1.524x3.936 hole 0.85: 41(-2.54,-25.197) 42(0,-25.197) 43(2.54,-25.197)
Screw-Hole-M2
  round 2 hole 2: 1(0,0)

## Nets
As in the schematic.

Pads without a net: 2 4 5 8 9 10 11 12 13 18 23 24 28 29 30 31 32 33 34 35 37 38 40 41 42 43; SCREW1 1; SCREW2 1; SCREW3 1; SCREW4 1; U5 0 6 7 8; U6 5 6 7 8 9 10 11 12 13 14 15 16; U7 1 2 3 7 9 12 13 14 15 16

## Via types
v1: diameter 0.61, hole 0.305, Top Layer to Bottom Layer, 5 vias

## Routing (per net, layer and track width the routed paths; a pad name or vN(x,y) marks a point on that pad's centre or on a via; arc(x,y) is an arc through that point)
GND: length 130.4
  Bottom Layer w0.254: 20.83,28.8 20.32,28.8 17.27,25.75 17.27,12.03 8.38,3.14 8.38,2.92 ; 20.83,28.8 24.13,25.5 29.21,25.5 29.97,24.73 29.97,21.69 37.08,14.57 38.51,14.57 U7.10 ; 20.83,28.8 20.07,29.56 20.07,32.1 U5.3 18.67,35.78 18.67,40.89 18.41,41.15 18.41,41.4 ; 18.41,41.4 13.65,41.4 U3.6 ; 18.41,41.4 18.41,42.42 19.8,43.81 19.8,51.17 20.7,52.07 34.42,52.07 U6.4 36.11,50.8 37.38,52.07 50.36,52.07 53.65,48.78 53.65,46.24 GND.1
VCC: length 78.4
  Top Layer w0.254: U6.1 43.56,50.42 42.29,49.15 U7.8 42.29,32.13 42.42,32 42.42,31.75 42.29,31.62 42.29,26.29 41.91,25.91 15.88,25.91 13.46,23.49 ; U3.7 16.45,39.24 16.45,32.92 U5.1 13.46,27.78 13.46,23.49 ; 13.46,23.49 2.36
$1N398: length 41.6
  Bottom Layer w0.254: U6.2 42.29,49.28 45.85,49.28 48.13,51.56 48.9,51.56 51.44,49.02 51.44,39.12 52.45,38.1 53.47,38.1 54.23,37.34 54.23,25.91 51.56,23.24
$1N399: length 40.3
  Top Layer w0.254: U6.3 38.74,50.55 40.26,52.07 48.39,52.07 49.78,50.67 49.78,24 2.22
$1N404: length 37.7
  Bottom Layer w0.254: 5.84,2.92 7.05,4.13 7.05,32.26 U3.5
$1N405: length 36.3
  Top Layer w0.254: U3.4 4.51,27.18 4.51,4.13 2.1
$1N408: length 47.7
  Top Layer w0.254: v1(20.83,26.52) 20.07,26.52 18.8,27.79 18.8,36.17 U5.4
  Bottom Layer w0.254: v1(20.83,26.52) 21.08,26.52 22.35,25.25 22.35,13.31 30.48,5.18 36.83,5.18 38.86,3.15 2.15
$1N409: length 52.3
  Top Layer w0.254: v1(20.07,27.54) 20.07,37.7 U5.5
  Bottom Layer w0.254: 36.32,2.92 36.32,2.14 34.8,0.62 30.73,0.62 29.97,1.38 29.97,4.93 19.81,15.09 19.81,27.29 v1(20.07,27.54)
$1N413: length 12.1
  Bottom Layer w0.254: 2.16 41.4,9.14 U7.11
$1N414: length 38.2
  Bottom Layer w0.254: 43.94,2.92 43.81,3.05 43.81,7.49 41.02,10.29 41.02,14.35 35.18,20.19 35.18,26.54 34.93,26.8 34.93,27.05 34.67,27.3 34.67,33.65 U7.4
$1N415: length 39.2
  Bottom Layer w0.254: 2.19 48.9,3.05 48.9,10.29 37.72,21.46 37.72,26.54 37.47,26.8 37.47,27.05 37.21,27.3 37.21,33.65 U7.5
$1N416: length 39.2
  Bottom Layer w0.254: 51.56,2.92 51.56,8.89 40.26,20.19 40.26,24.51 39.75,25.02 39.75,33.65 U7.6
$1N830: length 73.4
  Top Layer w0.254: 5.84,23.24 5.84,22.48 7.37,20.95 49.48,20.95 50.24,21.72 50.24,45.59 VSYS.1
$1N861: length 63.5
  Top Layer w0.254: GP4/4.1 51.62,38.7 51.62,26.09 52.63,25.07 52.63,21.52 37.14,6.02 18.85,6.02 16,3.17 16,2.92
$1N868: length 68.2
  Top Layer w0.254: 2.7 18.54,2.21 20.12,0.63 24.19,0.63 24.69,1.14 24.69,4.37 25.71,5.39 37.14,5.39 53.65,21.9 53.65,41.46 GP5/3.1
$1N897: length 26.7
  Bottom Layer w0.254: M1.1 53.65,35.95 53.65,33.41 52.89,32.65 51.87,32.65 50.35,31.12 50.35,27.31 47.54,24.51 47.54,21.1 47.4,20.95 43.48,20.95 41.68,22.75 41.68,22.96 2.25
$1N903: length 20.8
  Top Layer w0.254: 2.26 38.86,23.74 v1(40.44,25.32)
  Bottom Layer w0.254: v1(40.44,25.32) 40.7,25.58 47.81,25.58 49.84,27.61 49.84,31.42 M2.1
$1N913: length 27.2
  Top Layer w0.254: v1(41.46,20.28) v1(38.01,20.28)
  Bottom Layer w0.254: v1(41.46,20.28) 48.82,20.28 50.09,21.55 50.09,25.11 52.63,27.65 M3.1 ; 36.32,23.24 36.32,21.97 v1(38.01,20.28)
